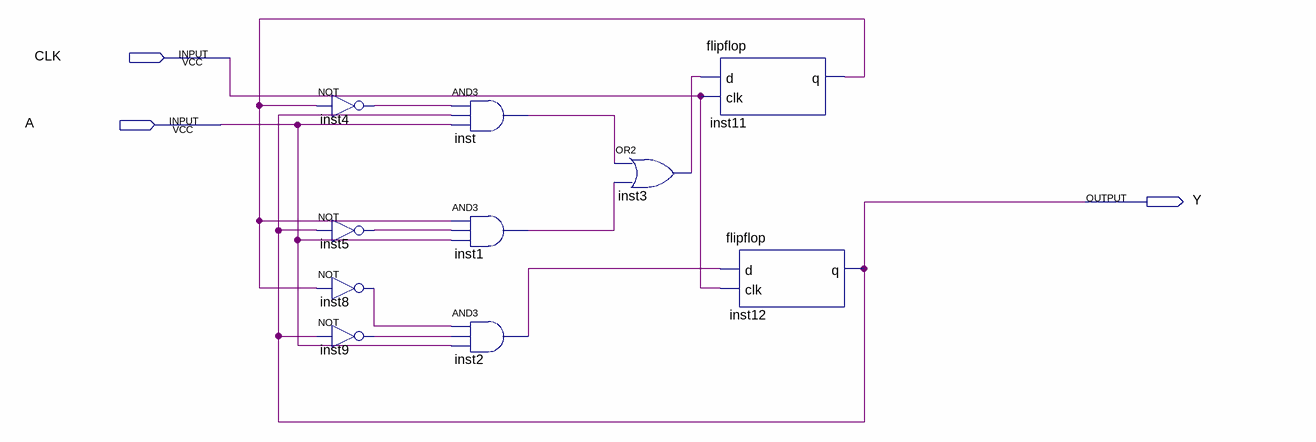
[diagram p0: schematic sheet]
// Quartus schematic fsm_moore.bdf as structural Verilog: 10 symbols, 3 pins
module fsm_moore (
  input  CLK,
  input  A,
  output Y
);

  wire inst1_out, inst2_out, inst3_out, inst4_out, inst5_out, inst8_out, inst9_out, inst11_q, inst_out;

  not inst4 (inst4_out, inst11_q);
  not inst5 (inst5_out, Y);
  not inst8 (inst8_out, inst11_q);
  not inst9 (inst9_out, Y);
  and inst (inst_out, inst4_out, Y, A);
  and inst1 (inst1_out, inst11_q, inst5_out, A);
  and inst2 (inst2_out, inst8_out, inst9_out, A);
  or inst3 (inst3_out, inst_out, inst1_out);
  flipflop inst11 (.d(inst3_out), .clk(CLK), .q(inst11_q));
  flipflop inst12 (.d(inst2_out), .clk(CLK), .q(Y));
endmodule
